# Altium schematic sheet debug.SchDoc
size A4; SheetNumber: 8; SheetTotal: 12
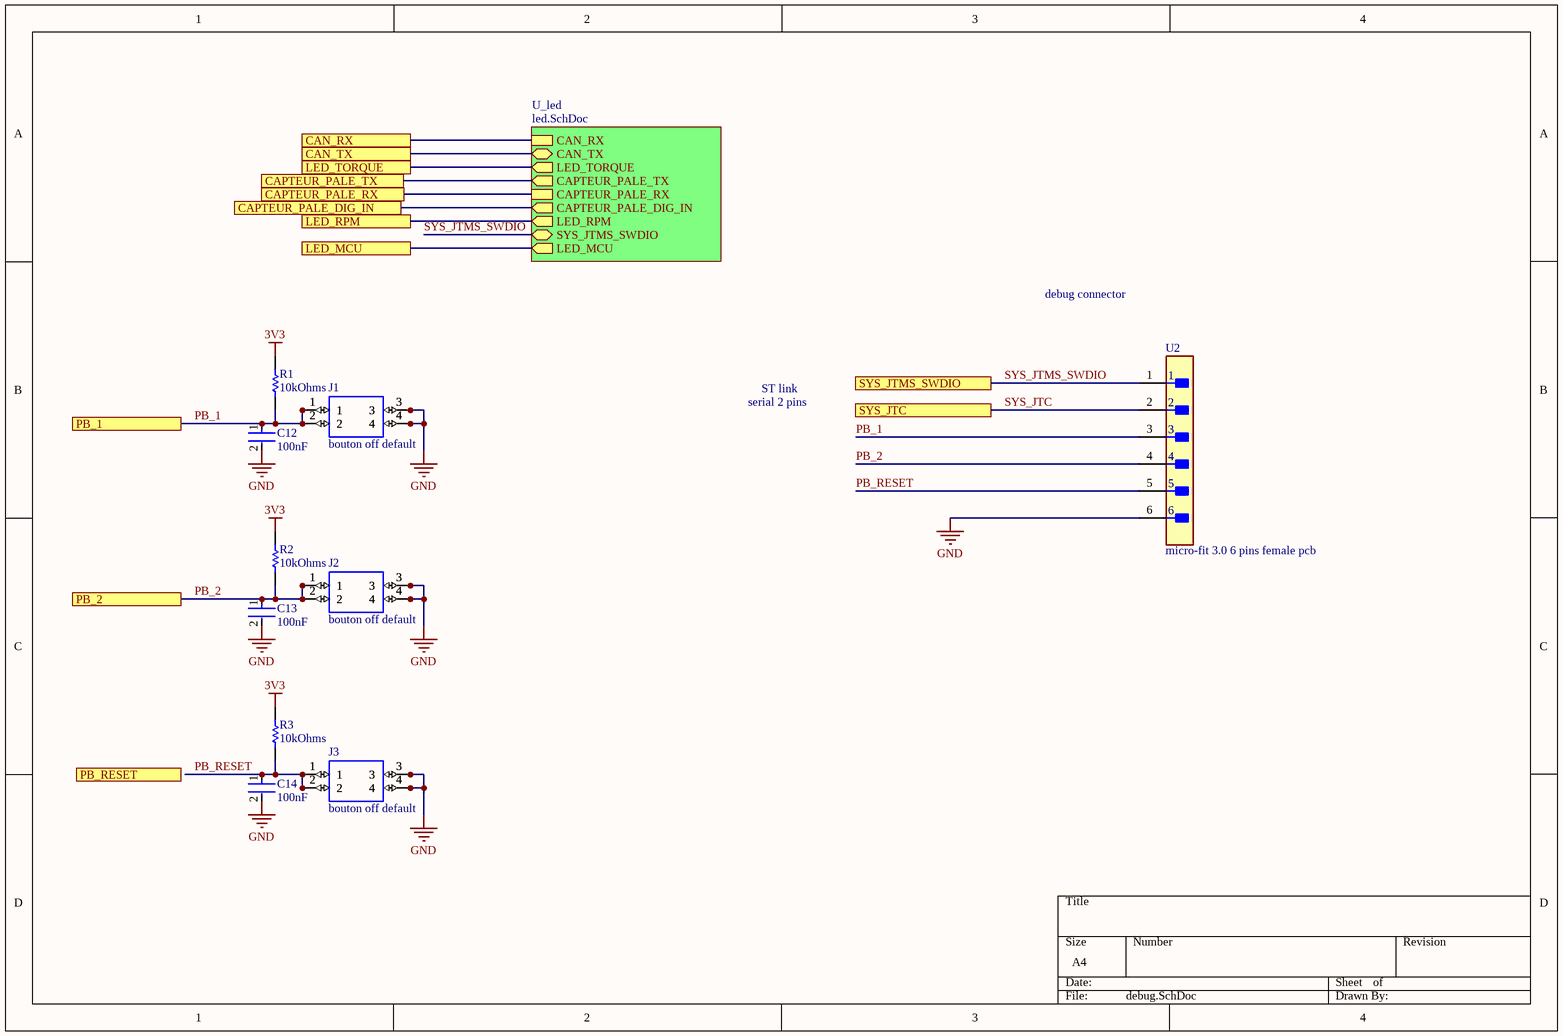
[diagram p0: debug.SchDoc]

## Parts
C12  100nF  [FP-CL278-IPC_A]
C13  100nF  [FP-CL278-IPC_A]
C14  100nF  [FP-CL278-IPC_A]
J1  bouton off default  [PTS810SJG250SMTRLFS]
J2  bouton off default  [PTS810SJG250SMTRLFS]
J3  bouton off default  [PTS810SJG250SMTRLFS]
R1  10kOhms  [FP-RC1005-MFG]
R2  10kOhms  [FP-RC1005-MFG]
R3  10kOhms  [FP-RC1005-MFG]
U2  micro-fit 3.0 6 pins female pcb  [FP-0430450600-MFG]

## Sub-sheets
U_led = led.SchDoc: CAN_RX, CAN_TX (bidir), LED_TORQUE (out), CAPTEUR_PALE_TX (out), CAPTEUR_PALE_RX, CAPTEUR_PALE_DIG_IN (out), LED_RPM (out), SYS_JTMS_SWDIO (bidir), LED_MCU (out)

## Ports
CAN_RX, CAN_TX, CAPTEUR_PALE_DIG_IN, CAPTEUR_PALE_RX, CAPTEUR_PALE_TX, LED_MCU, LED_RPM, LED_TORQUE, PB_1, PB_2, PB_RESET, SYS_JTC, SYS_JTMS_SWDIO

## Nets
3V3: R1.2 R2.2 R3.2
GND: C12.2 C13.2 C14.2 J1.3 J1.4 J2.3 J2.4 J3.3 J3.4 U2.6
CAN_RX: port CAN_RX, sheet U_led/CAN_RX
CAN_TX: port CAN_TX, sheet U_led/CAN_TX
CAPTEUR_PALE_DIG_IN: port CAPTEUR_PALE_DIG_IN, sheet U_led/CAPTEUR_PALE_DIG_IN
CAPTEUR_PALE_RX: port CAPTEUR_PALE_RX, sheet U_led/CAPTEUR_PALE_RX
CAPTEUR_PALE_TX: port CAPTEUR_PALE_TX, sheet U_led/CAPTEUR_PALE_TX
LED_MCU: port LED_MCU, sheet U_led/LED_MCU
LED_RPM: port LED_RPM, sheet U_led/LED_RPM
LED_TORQUE: port LED_TORQUE, sheet U_led/LED_TORQUE
PB_1: C12.1 J1.1 J1.2 R1.1 U2.3 ; port PB_1
PB_2: C13.1 J2.1 J2.2 R2.1 U2.4 ; port PB_2
PB_RESET: C14.1 J3.1 J3.2 R3.1 U2.5
SYS_JTC: U2.2 ; port SYS_JTC
SYS_JTMS_SWDIO: U2.1 ; port SYS_JTMS_SWDIO, sheet U_led/SYS_JTMS_SWDIO

## Notes on the sheet
- debug connector
- serial 2 pins
- ST link

## Library data of the parts
C12-C14 = CL05A104KA5NNNC: Multilayer Ceramic Capacitor, 0.1 uF, 25 V, ± 10%, X5R, 0402 [1005 Metric]; Manufacturer: Samsung; Material: 4241ConductorMaterial; Voltage Rating: 25V; Supplier: Digikey; Supplier Part Number: 1276-1043-1-ND; Manufacturer Part Number: CL05A104KA5NNNC; RoHS: Yes; Category: Ceramic Capacitors; Stock: 11930039; Pricing: 1=0.1, 10=0.01, 50=0.0054, 100=0.0042, 500=0.00318, 1000=0.0025, 2500=0.00227, 5000=0.00209 (USD); Mounting Technology: Surface Mount; Case/Package: 0402; Case Code (Metric): 1005; Case Code (Imperial): 0402; Min Operating Temperature: -55°C; Max Operating Temperature: 85°C; Value: 100nF; Packaging: Tape and Reel; Tolerance: 10%; Dielectric: X5R; Voltage: 25V; Series: CL; Construction: Flat; Package Quantity: 1; Voltage Rating (DC): 25V; Length: 1mm; Width: 0.02inch; Height: 0.5mm; Depth: 0.5mm; Thickness: 0.022inch; Radiation Hardening: No; RoHS Compliant: Yes; Lead Free: Lead Free; ComponentLink1URL: https://datasheet.ciiva.com/25802/cl05a104ka5nnnc-25802704.pdf?src-supplier=Digikey; ComponentLink1Description: https://datasheet.ciiva.com/25802/cl05a104ka5nnnc-25802704.pdf?src-supplier=Digikey; ComponentLink2URL: https://datasheet.ciiva.com/16437/cl05a104ka5nnnc-16437369.pdf?src-supplier=Future+Electronics; ComponentLink2Description: https://datasheet.ciiva.com/16437/cl05a104ka5nnnc-16437369.pdf?src-supplier=Future+Electronics; ComponentLink3URL: https://datasheet.ciiva.com/26838/getdatasheetpartid-357412-26838142.pdf?src-supplier=Verical; ComponentLink3Description: https://datasheet.ciiva.com/26838/getdatasheetpartid-357412-26838142.pdf?src-supplier=Verical; ComponentLink4URL: https://datasheet.ciiva.com/26309/mlcc-catalogdownload2013-eng-26309014.pdf?src-supplier=Distrelec; ComponentLink4Description: https://datasheet.ciiva.com/26309/mlcc-catalogdownload2013-eng-26309014.pdf?src-supplier=Distrelec
J1-J3 = PTS810SJK250SMTRLFS: Switch Tactile N.O. SPST Button J-Bend 0.05A 16VDC 50000Cycle 2.55N SMD T/R; Manufacturer: ITT C&K; Mechanical Life: 50000Cycles; Operating Force: 260gf; Current Rating: 50mA; Voltage Rating (DC): 16V; Illumination Type: Non-Illuminated; Switch Travel: 0.15mm; Switch Function: Off-Mom; Supplier: Digikey; Supplier Part Number: CKN10503CT-ND; Manufacturer Part Number: PTS810SJK250SMTRLFS; RoHS: Yes; Category: Tactile Switches; Stock: 151502; Pricing: 1=0.34, 10=0.325, 25=0.306, 100=0.2657, 250=0.24104, 500=0.22422, 1000=0.2018 (USD); Mounting Technology: Surface Mount; Case/Package: SMD/SMT; Color: White; Contact Plating: Silver; Min Operating Temperature: -40°C; Max Operating Temperature: 85°C; Throw Configuration: SPST; Packaging: Tape and Reel; Package Quantity: 2900; Series: PTS810; Lead Free: Lead Free; RoHS Compliant: Yes; ComponentLink1URL: https://datasheet.ciiva.com/18514/pts810-4mar13-18514062.pdf?src-supplier=Digikey; ComponentLink1Description: https://datasheet.ciiva.com/18514/pts810-4mar13-18514062.pdf?src-supplier=Digikey; ComponentLink2URL: https://datasheet.ciiva.com/18514/pts810-4mar13-18514063.pdf?src-supplier=Digikey; ComponentLink2Description: https://datasheet.ciiva.com/18514/pts810-4mar13-18514063.pdf?src-supplier=Digikey; ComponentLink3URL: https://datasheet.ciiva.com/18514/pts810-4mar13-18514061.pdf?src-supplier=Digikey; ComponentLink3Description: https://datasheet.ciiva.com/18514/pts810-4mar13-18514061.pdf?src-supplier=Digikey
R1-R3 = RC1005F103CS: Res Thick Film 0402 10K Ohm 1% 1/16W ±100ppm/°C Molded SMD SMD T/R; Manufacturer: Samsung; Value: 10kR; Power Rating: 63mW; Voltage Rating: 50V; Supplier: Digikey; Supplier Part Number: 1276-3431-1-ND; Manufacturer Part Number: RC1005F103CS; RoHS: Yes; Category: Chip SMD Resistors; Stock: 15479730; Pricing: 1=0.1, 10=0.024, 50=0.0156, 100=0.0132, 500=0.00922, 1000=0.00803, 5000=0.00598 (USD); Case/Package: 0402; Case Code (Metric): 1005; Case Code (Imperial): 0402; Contact Plating: Tin; Min Operating Temperature: -55°C; Max Operating Temperature: 155°C; Tolerance: 1%; Packaging: Tape and Reel; Package Quantity: 1; Number of Terminations: 2; Max Power Dissipation: 63mW; Temperature Coefficient: 100ppm/°C; Features: Moisture Resistant; Series: RC; Construction: Rectangular; Voltage Rating (DC): 50V; Length: 0.039inch; Width: 0.02inch; Height: 0.016inch; Depth: 0.5mm; Thickness: 350um; Radiation Hardening: No; Military Standard: Not; RoHS Compliant: Yes; Lead Free: 5697LeadFree; ComponentLink1URL: https://datasheet.ciiva.com/15196/getdatasheetpartid-504789-15196214.pdf?src-supplier=Verical; ComponentLink1Description: https://datasheet.ciiva.com/15196/getdatasheetpartid-504789-15196214.pdf?src-supplier=Verical; ComponentLink2URL: https://datasheet.ciiva.com/16481/rcseries-16481007.pdf?src-supplier=Future+Electronics; ComponentLink2Description: https://datasheet.ciiva.com/16481/rcseries-16481007.pdf?src-supplier=Future+Electronics
U2 = 430450600: Connector Wire to Board Header 6 Position 3mm Solder Right Angle Thru-Hole Tray; Manufacturer: Molex; Manufacturer Part Number: 43045-0600; Plating: 154ConductorMaterial; Contact Resistance: 10mR; Voltage Rating: 250V; Current Rating: 5A; Max Voltage Rating (DC): 250.25kV; Gender: Male; Number of Positions: 6; Insulation Resistance: 1GR; Approvals: UL,CSA,TUV; Glow Wire Compliant: 15Compliance; Supplier: Digikey; Supplier Part Number: WM1815-ND; RoHS: Yes; Category: Headers and Wire Housings; Stock: 3053; Pricing: 1=2.2, 10=1.875, 80=1.54863, 1728=1.18185, 5184=1.08404 (USD); Mounting Technology: Through Hole; Case/Package: SMC; Contact Material: Brass,Tin; Contact Plating: Tin; Housing Color: Black; Housing Material: Thermoplastic; Color: Black; Material: 4301ConductorMaterial; Min Operating Temperature: -40°C; Max Operating Temperature: 105°C; Number of Rows: 2; Packaging: Tray; Termination: Solder; Orientation: Right Angle; Package Quantity: 1728; Max Current Rating: 5A; Number of Circuits: 6; Number of Contacts: 6; Series: 43045; Voltage Rating (DC): 250V; Diameter: 3mm; Length: 13.15mm; Height: 8.77mm; Pitch: 3mm; Depth: 12.2mm; Row Spacing: 3mm; Radiation Hardening: No; Flammability Rating: UL94 V-0; RoHS Compliant: Yes; Reach SVHC Compliant: Unknown; Halogen Free: 5696HalogenFree; Lead Free: 5697LeadFree; Parameter 1: *